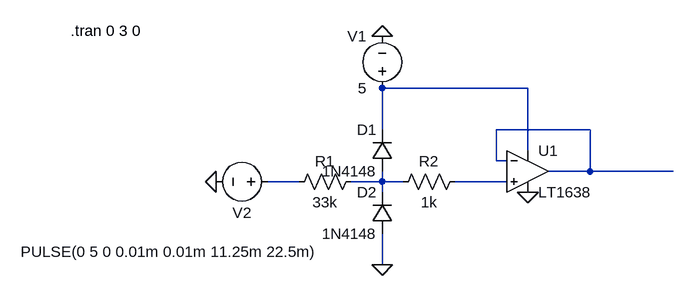
[diagram p0: schematic Schmitt Trigger Buffer.asc]
Schmitt Trigger Buffer.asc, the LTspice schematic file:
Version 4
SHEET 1 1116 680
WIRE 352 16 128 16
WIRE 128 80 128 16
WIRE 448 80 304 80
WIRE 352 112 352 16
WIRE 304 128 304 80
WIRE 320 128 304 128
WIRE 448 144 448 80
WIRE 448 144 384 144
WIRE 576 144 448 144
WIRE 0 160 -48 160
WIRE 128 160 128 144
WIRE 128 160 80 160
WIRE 160 160 128 160
WIRE 320 160 240 160
WIRE 128 176 128 160
WIRE 128 288 128 240
FLAG 128 288 0
FLAG 128 -64 0
FLAG -128 160 0
FLAG 352 176 0
SYMBOL diode 144 144 R180
WINDOW 0 24 64 Left 2
WINDOW 3 24 0 Left 2
SYMATTR InstName D1
SYMATTR Value 1N4148
SYMBOL diode 144 240 R180
WINDOW 0 24 64 Left 2
WINDOW 3 24 0 Left 2
SYMATTR InstName D2
SYMATTR Value 1N4148
SYMBOL res 96 144 R90
WINDOW 0 0 56 VBottom 2
WINDOW 3 32 56 VTop 2
SYMATTR InstName R1
SYMATTR Value 33k
SYMBOL voltage 128 32 R180
WINDOW 0 24 96 Left 2
WINDOW 3 24 16 Left 2
WINDOW 123 0 0 Left 0
WINDOW 39 0 0 Left 0
SYMATTR InstName V1
SYMATTR Value 5
SYMBOL voltage -32 160 R90
WINDOW 0 32 56 VTop 2
WINDOW 3 123 167 VBottom 2
WINDOW 123 0 0 Left 0
WINDOW 39 0 0 Left 0
SYMATTR InstName V2
SYMATTR Value PULSE(0 5 0 0.01m 0.01m 11.25m 22.5m)
SYMBOL OpAmps\\LT1638 352 80 R0
SYMATTR InstName U1
SYMBOL res 256 144 R90
WINDOW 0 0 56 VBottom 2
WINDOW 3 32 56 VTop 2
SYMATTR InstName R2
SYMATTR Value 1k
TEXT -352 -72 Left 2 !.tran 0 3 0

The netlist it stands for:
* Schmitt Trigger Buffer.asc
D1 N004 N001 1N4148
D2 0 N004 1N4148
R1 N004 N003 33k
V1 N001 0 5
V2 N003 0 PULSE(0 5 0 0.01m 0.01m 11.25m 22.5m)
XU1 N005 N002 N001 0 N002 LT1638  ; pins In+ In- V+ V- OUT
R2 N005 N004 1k
.model D D
.lib standard.dio
.tran 0 3 0
.backanno
.end